# Altium schematic sheet JL7016G8.SchDoc
size 266 x 203 mm; SheetNumber: 1; SheetTotal: 4
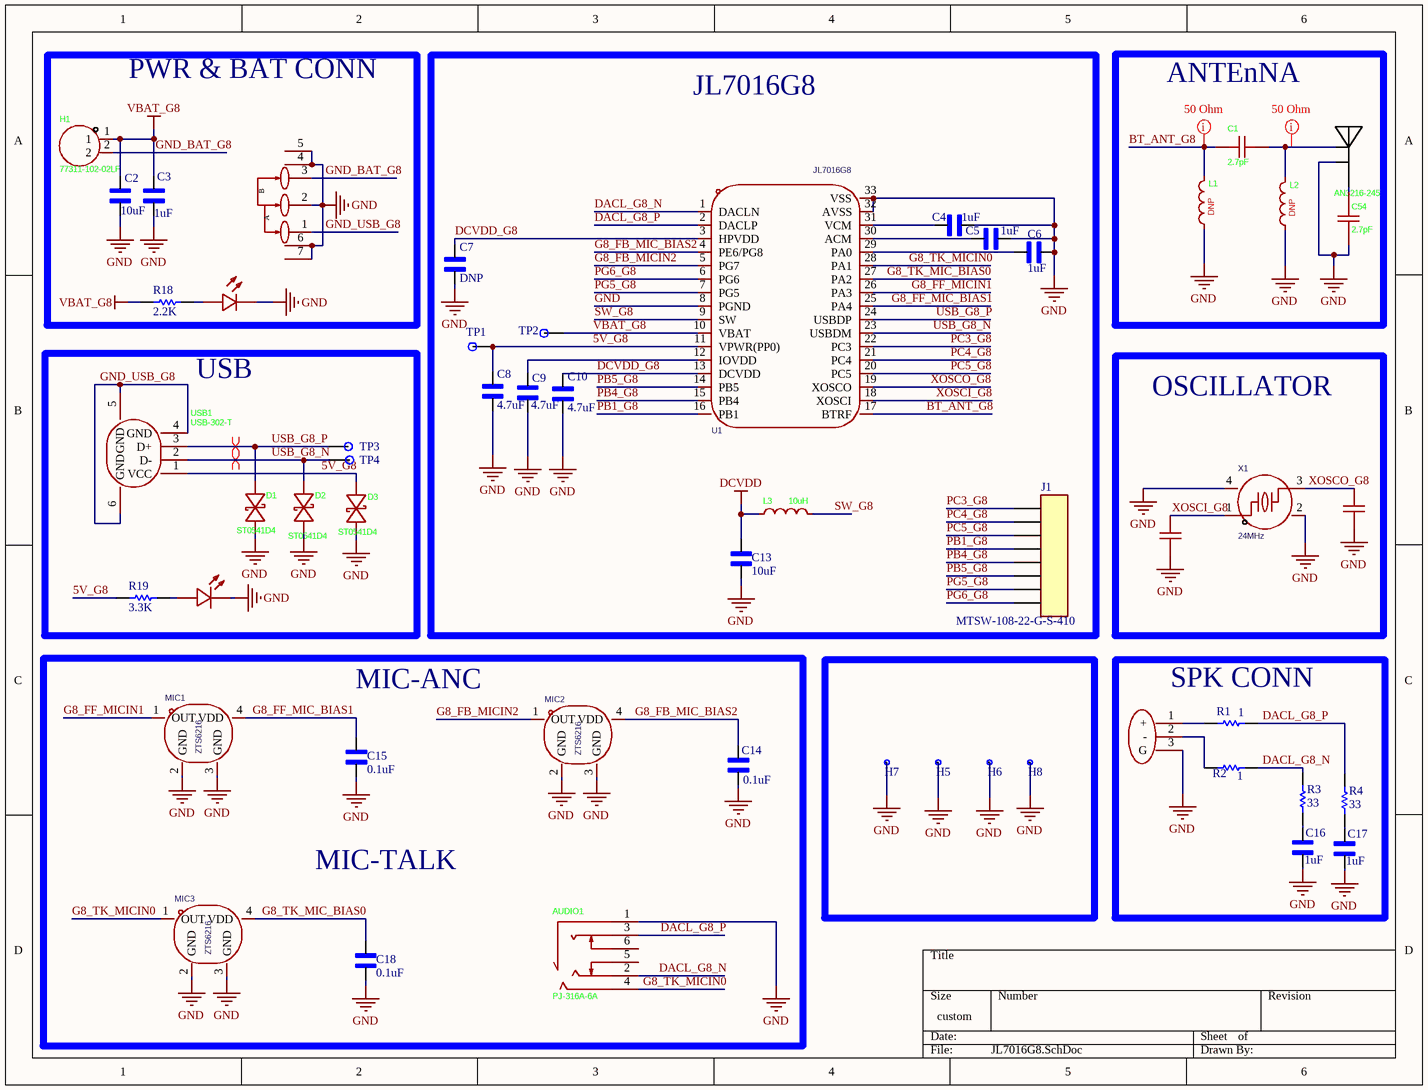
[diagram p0: JL7016G8.SchDoc]

## Parts
ANT1  AN3216-245  [CUSTOME ANTEENA]
AUDIO1  PJ-316A-6A  [AUDIO-SMD_PJ-316A-6A]
C1  2.7pF  [C0603]
C2  10uF  [CAPC3216X170N]
C3  1uF  [CAPC3216X170N]
C4  1uF  [CAPC3216X170N]
C5  1uF  [CAPC3216X170N]
C6  1uF  [CAPC3216X170N]
C7  value DNP  [CAPC3216X170N]  (hidden comment: 1uF)
C8  value 4.7uF  [CAPC3216X170N]  (hidden comment: 1uF)
C9  value 4.7uF  [CAPC3216X170N]  (hidden comment: 1uF)
C10  value 4.7uF  [CAPC3216X170N]  (hidden comment: 1uF)
C11  12pF  [CAPC3216X170N]  (value not drawn)
C12  12pF  [CAPC3216X170N]  (value not drawn)
C13  10uF  [CAPC3216X170N]
C14  0.1uF  [CAPC3216X170N]
C15  0.1uF  [CAPC3216X170N]
C16  1uF  [CAPC3216X170N]
C17  1uF  [CAPC3216X170N]
C18  0.1uF  [CAPC3216X170N]
C54  2.7pF  [C0402]
D1  ST0541D4  [DFN1006-BI]
D2  ST0541D4  [DFN1006-BI]
D3  ST0541D4  [DFN1006-BI]
H1  77311-102-02LF  [HDR-TH_2P-P2.54-V-M-1]
H5  MH  [MH]  (value not drawn)
H6  MH  [MH]  (value not drawn)
H7  MH  [MH]  (value not drawn)
H8  MH  [MH]  (value not drawn)
J1  MTSW-108-22-G-S-410  [SAMTEC_MTSW-108-22-G-S-410]
L1  DNP  [L0603]
L2  DNP  [L0603]
L3  10uH  [L0603]
LED1  LTST-C191GKT  [LED0603-R-RD_GREEN]  (value not drawn)
LED2  KT-0603R  [LED0603-RD]  (value not drawn)
MIC1  ZTS6216  [MIC-SMD_4P-L2.8-W1.9-P1.84-TL]
MIC2  ZTS6216  [MIC-SMD_4P-L2.8-W1.9-P1.84-TL]
MIC3  ZTS6216  [MIC-SMD_4P-L2.8-W1.9-P1.84-TL]
P1  1.27-1*3P针  [HDR-TH_3P-P1.27-V-M-1]  (value not drawn)
R1  value 1  [R0603]  (hidden comment: O OHM)
R2  value 1  [R0603]  (hidden comment: O OHM)
R3  value 33  [R0603]  (hidden comment: 33 Ohm)
R4  value 33  [R0603]  (hidden comment: 33 Ohm)
R18  value 2.2K  [R1206]
R19  3.3K  [R1206]
SW1  MK-12C02-G015  [SW-SMD_G-SWITCH_MK-12C02-G015]  (value not drawn)
TP1  TP_1  [TP]  (value not drawn)
TP2  TP_1  [TP]  (value not drawn)
TP3  TP_1  [TP]  (value not drawn)
TP4  TP_1  [TP]  (value not drawn)
U1  JL7016G8  [QFN-32_L4.0-W4.0-P0.40-TL-EP2.7]
USB1  USB-302-T  [USB-A-TH_USB-302-T]
X1  24MHz  [CRYSTAL-SMD_4P-L2.0-W1.6-BL-A]

## Blocks framed on the sheet
PWR & BAT CONN: C2 C3 H1 LED1 R18 SW1
JL7016G8: C4-C10 C13 J1 L3 TP1 TP2 U1
ANTEnNA: ANT1 C1 C54 L1 L2
USB: D1-D3 LED2 R19 TP3 TP4 USB1
OSCILLATOR: C11 C12 X1
SPK CONN: C16 C17 P1 R1-R4

## Nets
DCVDD: C13.2 L3.1
GND: ANT1.2 AUDIO1.1 C2.1 C3.2 C4.2 C5.2 C6.2 C7.2 C8.2 C9.2 C10.2 C11.1 C12.1 C13.1 C14.1 C15.1 C16.1 C17.1 C18.1 C54.1 D1.1 D2.1 D3.1 H5.1 H6.1 H7.1 H8.1 L1.1 L2.1 LED1.2(C) LED2.1(K) MIC1.2(GND) MIC1.3(GND) MIC2.2(GND) MIC2.3(GND) MIC3.2(GND) MIC3.3(GND) P1.3(G) SW1.2 SW1.4 SW1.5 SW1.6 SW1.7 U1.8(PGND) U1.32(AVSS) U1.33(VSS) X1.2(GND) X1.4(GND)
VBAT_G8: C2.2 C3.1 H1.1 R18.2 TP2.1 U1.10(VBAT)
5V_G8: C8.1 D3.2 R19.2 TP1.1 U1.11(VPWR(PP0)) USB1.1(VCC)
BT_ANT_G8: C1.1 L1.2 U1.17(BTRF)
DACL_G8_N: AUDIO1.2 R2.1 R3.1 U1.1(DACLN)
DACL_G8_P: AUDIO1.3 R1.1 R4.1 U1.2(DACLP)
DCVDD_G8: C7.1 C10.1 U1.3(HPVDD) U1.13(DCVDD)
G8_FB_MIC_BIAS2: C14.2 MIC2.4(VDD) U1.4(PE6/PG8)
G8_FB_MICIN2: MIC2.1(OUT) U1.5(PG7)
G8_FF_MIC_BIAS1: C15.2 MIC1.4(VDD) U1.25(PA4)
G8_FF_MICIN1: MIC1.1(OUT) U1.26(PA3)
G8_TK_MIC_BIAS0: C18.2 MIC3.4(VDD) U1.27(PA2)
G8_TK_MICIN0: AUDIO1.4 MIC3.1(OUT) U1.28(PA1)
GND_BAT_G8: H1.2 SW1.3
GND_USB_G8: SW1.1 USB1.4(GND) USB1.5(GND) USB1.6(GND)
PB1_G8: J1.04 U1.16(PB1)
PB4_G8: J1.05 U1.15(PB4)
PB5_G8: J1.06 U1.14(PB5)
PC3_G8: J1.01 U1.22(PC3)
PC4_G8: J1.02 U1.21(PC4)
PC5_G8: J1.03 U1.20(PC5)
PG5_G8: J1.07 U1.7(PG5)
PG6_G8: J1.08 U1.6(PG6)
SW_G8: L3.2 U1.9(SW)
USB_G8_N: D2.2 TP4.1 U1.23(USBDM) USB1.2(D-)
USB_G8_P: D1.2 TP3.1 U1.24(USBDP) USB1.3(D+)
XOSCI_G8: C12.2 U1.18(XOSCI) X1.1
XOSCO_G8: C11.2 U1.19(XOSCO) X1.3
NetANT1_1: ANT1.1 C1.2 L2.2
NetANT1_3: ANT1.3 C54.2
NetC4_1: C4.1 U1.31(VCM)
NetC5_1: C5.1 U1.30(ACM)
NetC6_1: C6.1 U1.29(PA0)
NetC9_1: C9.1 U1.12(IOVDD)
NetC16_2: C16.2 R3.2
NetC17_2: C17.2 R4.2
NetLED1_1: LED1.1(A) R18.1
NetLED2_2: LED2.2(A) R19.1
NetP1_1: P1.1(+) R1.2
NetP1_2: P1.2(-) R2.2

Not connected (* = marked no-connect by the designer): AUDIO1 5 6

## Layout directives
rule Width Constraint [Pref Impedance = 50.00ohms    Min Impedance = 50.00ohms    Max Impedance = 50.00ohms]: BT_ANT_G8, NetANT1_1
differential pair: USB_G8_N, USB_G8_P

## Notes on the sheet
- MIC-ANC
- MIC-TALK
- (in symbol MK-12C02-G015_C2911519) B; A

## Library data of the parts
ANT1 = AN3216-245: Manufacturer: Rainsun(霖昱微); Add into BOM: yes; Frequency(Center/Band): 2.45GHz; Bandwidth: 100MHz; Peak Gain: 0.5dBi; Impedance: 50Ω; Power: 1W; VSWR: 2.5; Symbol: AN3216-245; Device: AN3216-245; LCSC Part Name: AN3216-245; Supplier Part: C2916136; Manufacturer Part: AN3216-245; Supplier Footprint: 1206; JLCPCB Part Class: Extended Part; Datasheet: https://item.szlcsc.com/datasheet/AN3216-245/3211390.html; Supplier: LCSC; Convert to PCB: yes; Operating Temperature: -40℃~+85℃; Length: 3.2mm; Width: 1.6mm; Height: 1.3mm
AUDIO1 = PJ-316A-6A: Manufacturer: 韩国韩荣; Add into BOM: yes; Connector Type: 3.5mm Headphone Jack; Current Rating: 500mA; Voltage Rating (Max): 30V; Symbol: PJ-316A-6A; Device: PJ-316A-6A; LCSC Part Name: 3.5mm耳机座; Supplier Part: C128987; Manufacturer Part: PJ-316A-6A; Supplier Footprint: SMD; JLCPCB Part Class: Extended Part; Datasheet: https://item.szlcsc.com/datasheet/PJ-316A-6A/140273.html; Supplier: LCSC; Convert to PCB: yes; Contact Material: Phosphor Bronze; Contact Plating: Gold
C1 C54 = 0603CG2R7C500NT: Manufacturer: FH(风华); Add into BOM: yes; Voltage Rating: 50V; Temperature Coefficient: C0G; Symbol: 0603CG2R7C500NT; Device: 0603CG2R7C500NT; LCSC Part Name: ±0.25pF 2.7pF 50V; Supplier Part: C95180; Manufacturer Part: 0603CG2R7C500NT; Supplier Footprint: 0603; JLCPCB Part Class: Extended Part; Datasheet: https://item.szlcsc.com/datasheet/0603CG2R7C500NT/96381.html; Supplier: LCSC; Convert to PCB: yes; Value: 2.7pF
C2 C13 = CAP_10F: Value: 10uF
C3-C10 C16 C17 = CAP_1uF
  C3-C6 C16 C17: Value: 1uF
C11 C12 = 0402CG120J500NT: Manufacturer: FH(风华); Add into BOM: yes; Tolerance: ±5%; Voltage Rating: 50V; Temperature Coefficient: C0G; Symbol: 0402CG120J500NT; Device: 0402CG120J500NT; LCSC Part Name: 12pF ±5% 50V; Supplier Part: C1547; Manufacturer Part: 0402CG120J500NT; Supplier Footprint: 0402; JLCPCB Part Class: Basic Part; Datasheet: https://item.szlcsc.com/datasheet/0402CG120J500NT/1899.html; Supplier: LCSC; Convert to PCB: yes; Value: 12pF
C14 C15 C18 = CAP_0.1uF: 100nF 10V X7R ±5% 0402 Multilayer Ceramic Capacitors MLCC - SMD/SMT ROHS; Manufacturer: Walsin Tech Corp; MFR.Part #: 0402B104J100CT; JLCPCB Part #: C237170; Package: 0402; Value: 0.1uF
D1-D3 = ST0541D4: Manufacturer: Leiditech(雷卯电子); Add into BOM: yes; Reverse Stand-Off Voltage (Vrwm): 5V; Clamping Voltage: 23V; Peak Pulse Power Dissipation (Ppp): 110W@8/20us; Voltage - Breakdown: 6V; Reverse Leakage Current (Ir): 500nA; level of protection: IEC 61000-4-4；IEC 61000-4-5；IEC 61000-4-2; Type: ESD; Junction Capacitance: 0.22pF; Symbol: ST0541D4; Device: ST0541D4; LCSC Part Name: ESD 5V截止; Supplier Part: C5139355; Manufacturer Part: ST0541D4; Supplier Footprint: DFN1006-2; JLCPCB Part Class: Extended Part; Datasheet: https://item.szlcsc.com/datasheet/ST0541D4/5751044.html; Supplier: LCSC; Convert to PCB: yes
H1 = 77311-102-02LF: Manufacturer: Amphenol; Add into BOM: yes; Pitch: 2.54mm; Circluar Pins/Square Pins: Pin Header; Current Rating: 3A; Symbol: 77311-102-02LF; Device: 77311-102-02LF; LCSC Part Name: 间距:2.54mm 方针 直插; Supplier Part: C180247; Manufacturer Part: 77311-102-02LF; Supplier Footprint: 插件,P=2.54mm; JLCPCB Part Class: Extended Part; Datasheet: https://item.szlcsc.com/datasheet/77311-102-02LF/191642.html; Supplier: LCSC; Convert to PCB: yes; Pin Structure: -; Row Spacing: -; Mounting Type: Through Hole; Number of Rows: 1; Number of Pins: 2P; Voltage Rating (Max): -; Length of Mating Pin: -; Insulation Height: 2.54mm; Contact Material: Phosphor Bronze; Contact Plating: Tin; Operating Temperature: -65℃~+125℃; Color: Black
L1 L2 = 33nH: Manufacturer: muRata(村田); Symbol: DFE18SAN1R0ME0L; Add into BOM: yes; Value: 1uH; Tolerance: ±20%; Current Rating: 1.6A; DC Resistance(DCR): 144mΩ; Device: DFE18SAN1R0ME0L; LCSC Part Name: 1uH ±20%; Supplier Part: C2044564; Manufacturer Part: DFE18SAN1R0ME0L; Supplier Footprint: 0603; JLCPCB Part Class: Extended Part; Datasheet: https://atta.szlcsc.com/upload/public/pdf/source/20210601/1EEB72040C737E24AB5C3900F417DA4B.pdf; Supplier: LCSC; Convert to PCB: yes; Current - Saturation (Isat): -; Q @ Frequency: -; Frequency - Self Resonant: -; Ratings: -
L3 = 10uH: Value: 1uH; LCSC Part Name: 1uH ±20%; Q @ Frequency: -; Frequency - Self Resonant: -; Ratings: -
LED1 = LTST-C191GKT: -55℃~+85℃ 100mW 12mcd 130° 2.1V 20mA 565nm 569nm Discrete Diode Green Water Clear 0603 LED Indication - Discrete ROHS; Manufacturer: LITEON(光宝); Add into BOM: yes; Symbol: LTST-C191GKT; Device: LTST-C191GKT; LCSC Part Name: LTST-C191GKT; Supplier Part: C99289; Manufacturer Part: LTST-C191GKT; Supplier Footprint: 0603; JLCPCB Part Class: Extended Part; Datasheet: https://item.szlcsc.com/datasheet/LTST-C191GKT/100502.html; Supplier: LCSC; Convert to PCB: yes; Illumination Color: -; Voltage - Forward(Vf): 2.1V; Power(Watts): 100mW; Forward Current: 20mA; Wavelength - Dominant: 569nm; Peak Wavelength: 565nm; Diode Configuration: -; Lens Color: Water Clear; Color Temperature: -; Luminous Intensity: 12mcd; Viewing Angle: 130°; Mounting Style: -; Operating Temperature: -55℃~+85℃
LED2 = KT-0603R: Manufacturer: KENTO; Add into BOM: yes; Emitted Color: Red; Symbol: KT-0603R; Device: KT-0603R; LCSC Part Name: 0603 红灯 高亮; Supplier Part: C2286; Manufacturer Part: KT-0603R; Supplier Footprint: 0603; JLCPCB Part Class: Basic Part; Datasheet: https://atta.szlcsc.com/upload/public/pdf/source/20160616/1466072038404.pdf; Supplier: LCSC; Convert to PCB: yes; Power Dissipation: -; Forward Current: -; Dominant Wavelength: -; Peak Wavelength: -; Diode Configuration: -; Lens Color: -; Color Temperature: -; Viewing Angle: -; Mounting Sytle: -; Operating Temperature: -40℃~+85℃
MIC1-MIC3 = ZTS6216: Manufacturer: ZILLTEK(钰太); Add into BOM: yes; Direction: Omnidirectional; Voltage - Supply: 1.5V~3.6V; Current Consumption: 120uA; S/N Ratio: 65dB; Sensitivity: -38dB; Impedance: 100Ω; Output Type: 模拟输出; Symbol: ZTS6216; Device: ZTS6216; LCSC Part Name: 1.5V~3.6V38dB; Supplier Part: C481302; Manufacturer Part: ZTS6216; Supplier Footprint: SMD-4P,2.8x1.9mm; JLCPCB Part Class: Extended Part; Datasheet: https://item.szlcsc.com/datasheet/ZTS6216/488750.html; Supplier: LCSC; Convert to PCB: yes; Length: 2.75mm; Width: 1.85mm; Height: 1mm
P1 = 1.27-1*3P针: Manufacturer: BOOMELE(博穆精密); Symbol: 1.27mm/1*3p; Add into BOM: yes; Pin Structure: 1x3P; Pitch: 1.27mm; Circluar Pins/Square Pins: Pin Header; Current Rating: 3A; Device: 1.27-1*3P针; LCSC Part Name: 1x3P 间距:1.27mm 方针 直插; Supplier Part: C24980; Manufacturer Part: 1.27-1*3P针; Supplier Footprint: 插件,P=1.27mm; JLCPCB Part Class: Extended Part; Datasheet: https://item.szlcsc.com/datasheet/1.27-1*3P%25E9%2592%2588/25717.html; Supplier: LCSC; Convert to PCB: yes; Row Spacing: -; Mounting Type: Through Hole; Number of Rows: 1; Number of Pins: 3P; Voltage Rating (Max): -; Length of Mating Pin: 3mm; Insulation Height: 1.7mm; Length of End Connection Pin: 2.5mm; Contact Material: Brass; Contact Plating: -; Operating Temperature: -55℃~+105℃; Color: Black; Supplementary Features: -
R1 R2 = RES_1: -55℃~+155℃ 33Ω 50V 62.5mW Thick Film Resistor ±100ppm/℃ ±5% 0402 Chip Resistor - Surface Mount ROHS; Manufacturer: YAGEO; MFR.Part #: RC0402JR-0733RL; JLCPCB Part #: C137880; Package: 0402
R3 R4 = RES_33: -55℃~+155℃ 33Ω 50V 62.5mW Thick Film Resistor ±100ppm/℃ ±5% 0402 Chip Resistor - Surface Mount ROHS; Manufacturer: YAGEO; MFR.Part #: RC0402JR-0733RL; JLCPCB Part #: C137880; Package: 0402
R18 = RES_2.2K: -55℃~+155℃ 33Ω 50V 62.5mW Thick Film Resistor ±100ppm/℃ ±5% 0402 Chip Resistor - Surface Mount ROHS; Manufacturer: YAGEO; MFR.Part #: RC0402JR-0733RL; JLCPCB Part #: C137880; Package: 0402
R19 = RES_3.3K: -55℃~+155℃ 33Ω 50V 62.5mW Thick Film Resistor ±100ppm/℃ ±5% 0402 Chip Resistor - Surface Mount ROHS; Manufacturer: YAGEO; MFR.Part #: RC0402JR-0733RL; JLCPCB Part #: C137880; Package: 0402; Value: 3.3K
SW1 = MK-12C02-G015_C2911519: Manufacturer: G-Switch(品赞); Add into BOM: yes; Circuit: SPDT; Actuator Style: Rectangular Columnar; Switch Height: 4.2mm; Actuator Color: Black; Current Rating: 1A; Voltage Rating: 6V; Life: 10,000 Cycles; Symbol: MK-12C02-G015; Device: MK-12C02-G015_C2911519; LCSC Part Name: 七脚贴片微型拨动开关 G1.5; Supplier Part: C2911519; Manufacturer Part: MK-12C02-G015; Supplier Footprint: SMD,6.6x1.4mm; JLCPCB Part Class: Extended Part; Datasheet: https://item.szlcsc.com/datasheet/MK-12C02-G015/3191561.html; Supplier: LCSC; Convert to PCB: yes; Termination Style: -; Length: 6.6mm; Width: 1.4mm; Mounting Type: Surface Mount, Right Angle; Operating Temperature: -20℃~+70℃
TP1-TP4 = TP_1: test point
U1 = JL7016G8: Manufacturer: JL(杰理); Add into BOM: yes; Symbol: JL7016G8; Device: JL7016G8; LCSC Part Name: JL7016G8; Supplier Part: C22440782; Manufacturer Part: JL7016G8; Supplier Footprint: QFN-32(4x4); JLCPCB Part Class: Extended Part; Datasheet: https://atta.szlcsc.com/upload/public/pdf/source/20240530/E944A80303950A6147680AC436B49373.pdf; Supplier: LCSC; Convert to PCB: yes
USB1 = USB-302-T: Manufacturer: SOFNG(硕方); Add into BOM: yes; Connector Type: Type-A; Protocol Standard: USB 2.0; Gender: Female; Number of Contacts: 4P; Number of Ports: 1; Current Rating-Power: 50mA; Voltage Rating: 24V; Detection color: White; Symbol: USB-302; Device: USB-302-T; LCSC Part Name: Type-A 母 弯插; Supplier Part: C112456; Manufacturer Part: USB-302-T; Supplier Footprint: 弯插; JLCPCB Part Class: Extended Part; Datasheet: https://item.szlcsc.com/datasheet/USB-302-T/113689.html; Supplier: LCSC; Convert to PCB: yes; Mounting Type: Right Angle; Operating Temperature: -25℃~+75℃
X1 = XL7EL89CKI-111YLC-24M: Manufacturer: YXC(扬兴晶振); Add into BOM: yes; Normal temperature Frequency Tolerance: ±10ppm; Load Capacitance: 8pF; Frequency Stability: ±20ppm; Symbol: XL7EL89CKI-111YLC-24M; Device: XL7EL89CKI-111YLC-24M; LCSC Part Name: YSX211SL 24MHZ 4P 2016 8PF ±10PPM -40~85℃ (±20PPM); Supplier Part: C2965580; Manufacturer Part: XL7EL89CKI-111YLC-24M; Supplier Footprint: SMD2016-4P; JLCPCB Part Class: Extended Part; Datasheet: https://item.szlcsc.com/datasheet/XL7EL89CKI-111YLC-24M/3357716.html; Supplier: LCSC; Convert to PCB: yes; Type: Surface Mount Crystal; Value: 24MHz; Equivalent Series Resistance(ESR): -; Operating Temperature: -40℃~+85℃
J1 = MTSW-108-22-G-S-410: MP: MTSW-108-22-G-S-410; Price: None; Package: None; Value: *; Availability: Unavailable